# Altium schematic sheet 220,small.SchDoc
size A
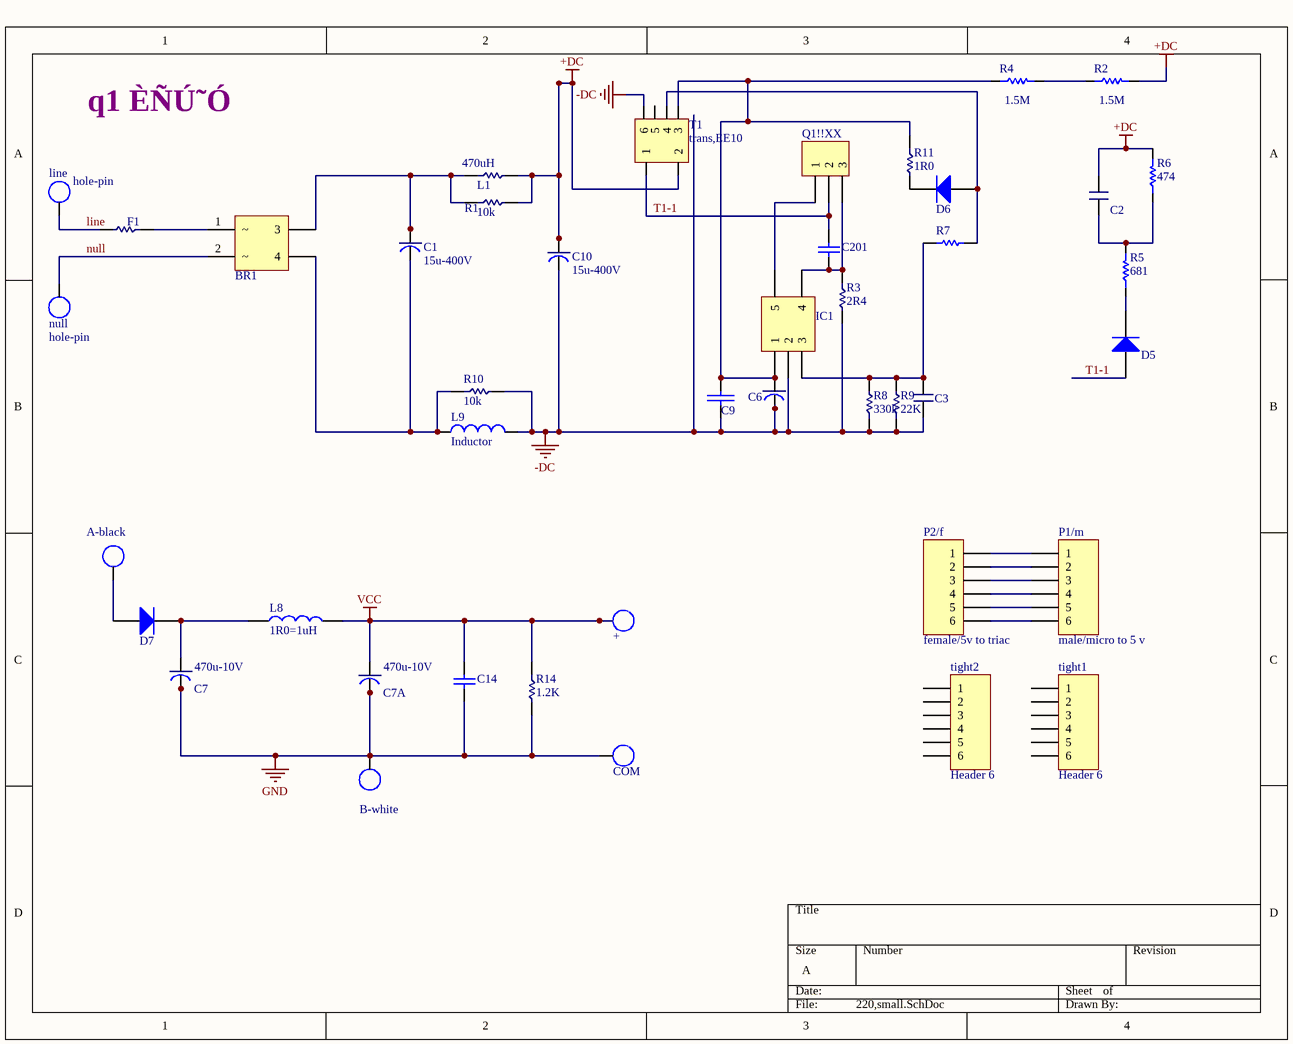
[diagram p0: 220,small.SchDoc]

## Parts
+  hole-pin  [holepin]  (value not drawn)
A-black  hole-pin  [holepin]  (value not drawn)
B-white  hole-pin  [holepin]  (value not drawn)
BR1  Bridge  [MB108]  (value not drawn)
C1  15u-400V  [15u-400V]
C2  CAP  [805]  (value not drawn)
C3  CAP  [805]  (value not drawn)
C6  cap-47u-50V  [cap47]  (value not drawn)
C7  470u-10V  [470u-10V]
C7A  470u-10V  [470u-10V]
C9  (no value)  [SMD_CAP_0805]
C10  15u-400V  [15u-400V]
C14  Cap Semi  [1608[0603]]  (value not drawn)
C201  Cap Semi  [C1206]  (value not drawn)
COM  hole-pin  [holepin]  (value not drawn)
D5  diode  [diode]  (value not drawn)
D6  diode  [diode]  (value not drawn)
D7  Diode  [SB340s]  (value not drawn)
F1  fuse-R  [fuse_r]  (value not drawn)
IC1  Ic in sw supply small(1A17?)  [SOT23-5AM]  (value not drawn)
L1  470uH  [fuse_r]
L8  1R0=1uH  [self]
L9  Inductor  [INDC3216]
line  hole-pin  [hole-pin]
null  hole-pin  [hole-pin]
P1/m  male/micro to 5 v  [HDR1X6]
P2/f  female/5v to triac  [HDR1X6]
Q1!!XX  Q  [Q]  (value not drawn)
R1  value 10k  [805]  (hidden comment: RES)
R2  1.5M  [RES 1206 (3216X08L)]
R3  value 2R4  [805]  (hidden comment: RES)
R4  1.5M  [RES 1206 (3216X08L)]
R5  681  [RES 1206 (3216X08L)]
R6  474  [RES 1206 (3216X08L)]
R7  Res1  [AXIAL-0.3]  (value not drawn)
R8  value 330k  [805]  (hidden comment: RES)
R9  value 22K  [805]  (hidden comment: RES)
R10  value 10k  [805]  (hidden comment: RES)
R11  value 1R0  [805]  (hidden comment: RES)
R14  value 1.2K  [805]  (hidden comment: RES)
T1  trans,EE10  [trans,EE10]
tight1  Header 6  [HDR1X6]
tight2  Header 6  [HDR1X6]

## Nets
+DC: C2.2 C10.1 L1.2 R1.2 R2.2 R6.2 T1.2
-DC: C3.2 C6.2 C9.2(-) C10.2 IC1.2 L9.2 R3.2 R8.1 R9.1 R10.2 T1.6
GND: B-white.0 C7.2 C7A.2 C14.1 COM.0 R14.2
VCC: +.0 C7A.1 C14.2 L8.2 R14.1
line: F1.2 line.0
null: BR1.2 null.0
T1-1: C201.2 D5.1 Q1!!XX.2 T1.1
NetA-black_0: A-black.0 D7.1
NetBR1_1: BR1.1 F1.1
NetBR1_3: BR1.3 C1.1 L1.1 R1.1
NetBR1_4: BR1.4 C1.2 L9.1 R10.1
NetC2_1: C2.1 R5.2 R6.1
NetC3_1: C3.1 IC1.3 R7.2 R8.2 R9.2
NetC6_1: C6.1 C9.1(+) IC1.1 R4.1 R11.1 T1.3
NetC7_1: C7.1 D7.2 L8.1
NetC201_1: C201.1 IC1.4 Q1!!XX.3 R3.1
NetD5_2: D5.2 R5.1
NetD6_1: D6.1 R7.1 T1.4
NetD6_2: D6.2 R11.2
NetIC1_5: IC1.5 Q1!!XX.1
NetP1/m_1: P1/m.1 P2/f.1
NetP1/m_2: P1/m.2 P2/f.2
NetP1/m_3: P1/m.3 P2/f.3
NetP1/m_4: P1/m.4 P2/f.4
NetP1/m_5: P1/m.5 P2/f.5
NetP1/m_6: P1/m.6 P2/f.6
NetR2_1: R2.1 R4.2

Not connected (* = marked no-connect by the designer): T1 5; tight1 1 2 3 4 5 6; tight2 1 2 3 4 5 6

## Notes on the sheet
- q1 ÈÑÚ˜Ó  ÒÏå ÔæÏ

## Library data of the parts
C1 C7 C7A C10 = Cap Pol
C2 C3 = C: value: 100nF
C6 = cap: cap-10u-50V
C9 = Cap-Bipolar: Bipolar Capacitor; Voltage: 100V; Designer: Saeid Jorablo; Organazation: ControTec; Adding Date: 1387/12/20
C14 C201 = Cap Semi: Capacitor (Semiconductor SIM Model); Published: 8-Jun-2000; LatestRevisionDate: 29-May-2009; LatestRevisionNote: IPC-7351 Footprint Added.; PackageReference: C1206; Publisher: Altium Limited; PackageDescription: Chip Capacitor
D5 D6 = diode: diode istade
F1 L1 = fuse: ohmic fuse
IC1 = IC,(1A17?)
L8 = self
L9 = Inductor: Code_IEC: 1005; Published: 8-Jun-2000; LatestRevisionDate: 29-May-2009; LatestRevisionNote: IPC-7351 Footprint Added.; PackageReference: 0402-A; Publisher: Altium Limited; PackageDescription: Chip Inductor; Code_JEITA: 0402
P1/m P2/f tight1 tight2 = Header 6: Header, 6-Pin; LatestRevisionDate: 17-Jul-2002; LatestRevisionNote: Re-released for DXP Platform.; Publisher: Altium Limited
R1 R3 R8-R11 R14 = R
R2 R4-R6 = Resistor
  R2 R4: Value: 1.5M
  R5: Value: 681
  R6: Value: 474
R7 = Res1: Resistor; Published: 8-Jun-2000; LatestRevisionDate: 17-Jul-2002; LatestRevisionNote: Re-released for DXP Platform.; PackageReference: AXIAL-0.3; Publisher: Altium Limited; PackageDescription: Axial Device, Thru-Hole; 2 Leads; 0.3 in Pin Spacing